# EAGLE schematic rs485 (EAGLE 7.5.0)
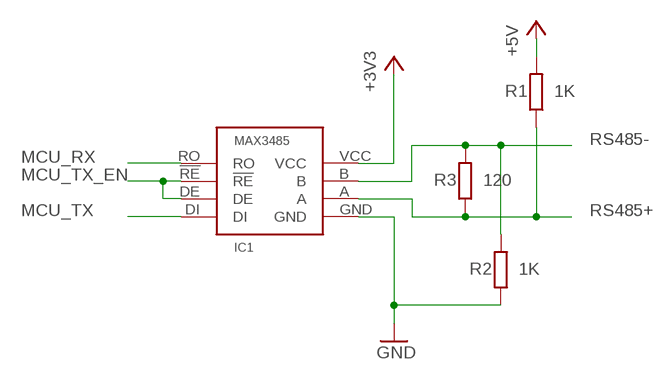
[diagram p0: schematic, sheet 1]

## Parts
IC1  MAX3485  MAX485  [DIL08]
R1  1K  R-EU_0204/7  [0204/7]
R2  1K  R-EU_0204/7  [0204/7]
R3  120  R-EU_0204/7  [0204/7]

## Nets
+3V3: IC1.VCC
+5V: R1.2
GND: IC1.GND R2.1
MCU_RX: IC1.RO
MCU_TX: IC1.DI
MCU_TX_EN: IC1.!RE IC1.DE
RS485+: IC1.A R1.1 R3.1
RS485-: IC1.B R2.2 R3.2

## Library data of the parts
IC1 = max348x:MAX485
R1-R3 = rcl:R-EU_: RESISTOR, European symbol

## Module MCU
Ports: UART_TX(io)

### Library data of the parts